# Altium schematic sheet THUSBC.SchDoc
size A
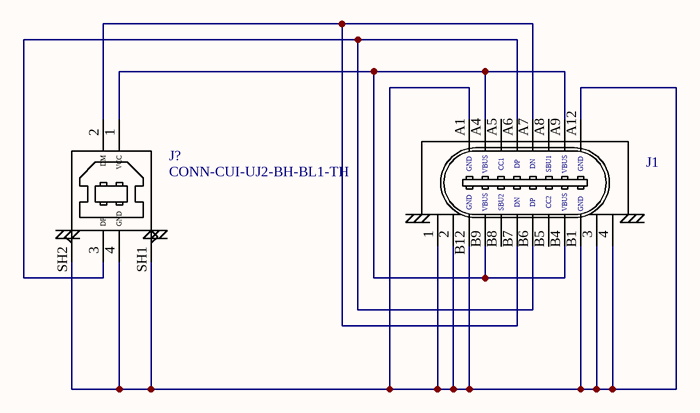
[diagram p0: THUSBC.SchDoc]

## Parts
J1  CONN-USBC-USB2-HOR  [CONN-GCT-USB4085]  (value not drawn)
J?  CONN-CUI-UJ2-BH-BL1-TH  [CONN-CUI-UJ2-BH-BL1-TH]

## Nets
NetJ1_1: J1.1 J1.2 J1.3 J1.4 J1.A1 J1.A12 J1.B1 J1.B12 J?.4(GND) J?.SH1(NO) J?.SH2(NO)
NetJ1_A4: J1.A4 J1.A9 J1.B4 J1.B9 J?.1(VCC)
NetJ1_A6: J1.A6 J1.B6 J?.3(DP)
NetJ1_A7: J1.A7 J1.B7 J?.2(DM)

Not connected (* = marked no-connect by the designer): J1 A5 A8 B5 B8

## Notes on the sheet
- (in symbol CONN-USBC-USB2-HOR) GND; VBUS; CC1; DP; DN; SBU1; SBU2; CC2

## Library data of the parts
J1 = CONN-USBC-USB2-HOR: CONN,USB-C,16P,RA,TH,8.94X9.17; Manufacturer 1: GCT; Manufacturer Part Number 1: USB4085-GF-A; Supplier 1: Digikey; Supplier Part Number 1: 2073-USB4085-GF-ACT-ND; LCSC: C7095263; MOUSER: 640-USB4085-GF-A
J? = CONN-CUI-UJ2-BH-BL1-TH: CONN,USB2.0,B,RA,BLUE; LCSC: C720549